# EAGLE design Moh2_RPi_HAT (EAGLE 9.5.0)
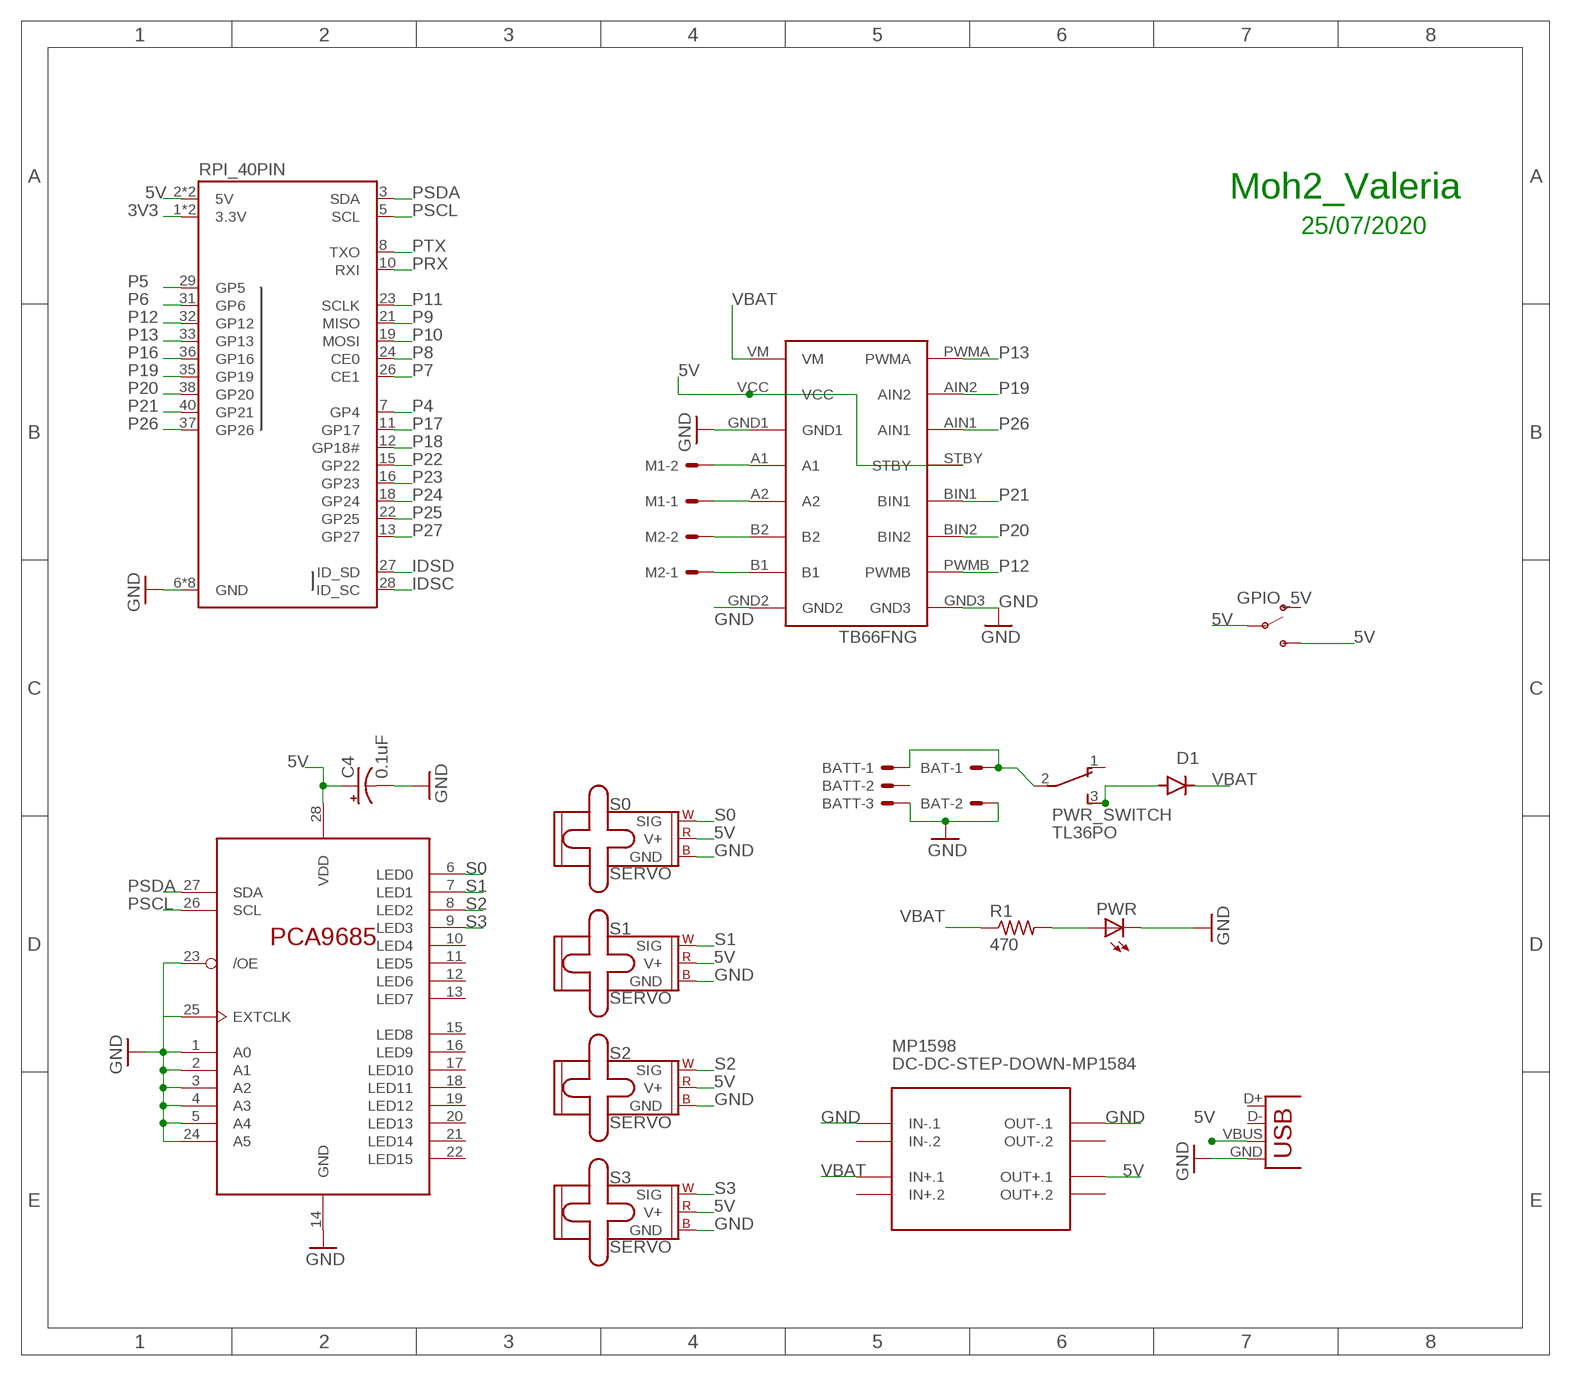
[diagram p0: schematic, sheet 1]

## Parts
BAT  22-05-7028-02  [7395-02]
BATT  22-05-7038-03  [7395-03]
C4  0.1uF  CPOL-USE1.8-4  [E1,8-4]
D1  1N5400  [DO201-15]
GPIO_5V  SWITCH-SPDT-PTH-11.6X4.0MM  [SWITCH_SPDT_PTH_11.6X4.0MM]
M1  22-05-7028-02  [7395-02]
M2  22-05-7028-02  [7395-02]
MP1598  DC-DC-STEP-DOWN-MP1584  [DC-DC-STEP-DOWN-MP1584]
PCA96  PCA9685PW  [TSSOP28]
PWR  LED5MM  [LED5MM]
PWR_SWITCH  TL36PO  [TL3XPO]
R1  470  R-US_0204/7  [0204/7]
RPI_40PIN  RASPBERRYPI-40-PIN-GPIO_PTH_NO_SHROUD  [2X20]
RPI_PWR  USB-A-H  [USB-A-H]
S0  SERVO  [1X03]
S1  SERVO  [1X03]
S2  SERVO  [1X03]
S3  SERVO  [1X03]
TB66FNG  TB6612FNG  [TB6612FNG]

## Nets
3V3: RPI_40PIN.1(3.3V) RPI_40PIN.17(3.3V)
5V: C4.+ GPIO_5V.2(P) GPIO_5V.3(S) MP1598.OUT+.1 PCA96.28(VDD) RPI_40PIN.2(5V) RPI_40PIN.4(5V) RPI_PWR.VBUS S0.2(V+) S1.2(V+) S2.2(V+) S3.2(V+) TB66FNG.STBY TB66FNG.VCC
11.1V+: BAT.1 BATT.1 PWR_SWITCH.2(P)
GND: BAT.2 BATT.3 C4.- MP1598.IN-.1 MP1598.OUT-.1 PCA96.1(A0) PCA96.2(A1) PCA96.3(A2) PCA96.4(A3) PCA96.5(A4) PCA96.14(GND) PCA96.23(/OE) PCA96.24(A5) PCA96.25(EXTCLK) PWR.K(C) RPI_40PIN.6(GND) RPI_40PIN.9(GND) RPI_40PIN.14(GND) RPI_40PIN.20(GND) RPI_40PIN.25(GND) RPI_40PIN.30(GND) RPI_40PIN.34(GND) RPI_40PIN.39(GND) RPI_PWR.GND S0.3(GND) S1.3(GND) S2.3(GND) S3.3(GND) TB66FNG.GND1 TB66FNG.GND2 TB66FNG.GND3
IDSC: RPI_40PIN.28(ID_SC)
IDSD: RPI_40PIN.27(ID_SD)
N$2: M2.2 TB66FNG.B2
N$3: D1.A PWR_SWITCH.3(S)
N$4: M1.2 TB66FNG.A1
N$5: M1.1 TB66FNG.A2
N$6: M2.1 TB66FNG.B1
N$10: PWR.A R1.2
P4: RPI_40PIN.7(GP4)
P5: RPI_40PIN.29(GP5)
P6: RPI_40PIN.31(GP6)
P7: RPI_40PIN.26(CE1)
P8: RPI_40PIN.24(CE0)
P9: RPI_40PIN.21(MISO)
P10: RPI_40PIN.19(MOSI)
P11: RPI_40PIN.23(SCLK)
P12: RPI_40PIN.32(GP12) TB66FNG.PWMB
P13: RPI_40PIN.33(GP13) TB66FNG.PWMA
P16: RPI_40PIN.36(GP16)
P17: RPI_40PIN.11(GP17)
P18: RPI_40PIN.12(GP18#)
P19: RPI_40PIN.35(GP19) TB66FNG.AIN2
P20: RPI_40PIN.38(GP20) TB66FNG.BIN2
P21: RPI_40PIN.40(GP21) TB66FNG.BIN1
P22: RPI_40PIN.15(GP22)
P23: RPI_40PIN.16(GP23)
P24: RPI_40PIN.18(GP24)
P25: RPI_40PIN.22(GP25)
P26: RPI_40PIN.37(GP26) TB66FNG.AIN1
P27: RPI_40PIN.13(GP27)
PRX: RPI_40PIN.10(RXI)
PSCL: PCA96.26(SCL) RPI_40PIN.5(SCL)
PSDA: PCA96.27(SDA) RPI_40PIN.3(SDA)
PTX: RPI_40PIN.8(TXO)
S0: PCA96.6(LED0) S0.1(SIG)
S1: PCA96.7(LED1) S1.1(SIG)
S2: PCA96.8(LED2) S2.1(SIG)
S3: PCA96.9(LED3) S3.1(SIG)
VBAT: D1.C MP1598.IN+.1 R1.1 TB66FNG.VM
Unconnected: BATT.2 GPIO_5V.1(O) MP1598.IN+.2 MP1598.IN-.2 MP1598.OUT+.2 MP1598.OUT-.2 PCA96.10(LED4) PCA96.11(LED5) PCA96.12(LED6) PCA96.13(LED7) PCA96.15(LED8) PCA96.16(LED9) PCA96.17(LED10) PCA96.18(LED11) PCA96.19(LED12) PCA96.20(LED13) PCA96.21(LED14) PCA96.22(LED15) PWR_SWITCH.1(O) RPI_PWR.D+ RPI_PWR.D-

## Notes on the sheet
- Moh2_Valeria
- 25/07/2020

## Library data of the parts
BAT M1 M2 = con-molex:22-?-02: CONNECTOR wire to board 2.54 mm (.1 inch) pitch header; MF: MOLEX; OC_FARNELL: 9731601; OC_NEWARK: unknown
BATT = con-molex:22-?-03: CONNECTOR wire to board 2.54 mm (.1 inch) pitch header; MF: MOLEX; OC_FARNELL: unknown; OC_NEWARK: unknown
C4 = rcl:CPOL-US: POLARIZED CAPACITOR, American symbol; SPICEPREFIX: C
D1 = diode:1N5400: DIODE standard rectifier, 3 A, 50 V (Motorola)
GPIO_5V = SparkFun-Switches:SWITCH-SPDT: Single Pole, Double Throw (SPDT) Switch Single-pole, double-throw (SPDT) switch. Variant Overview SMD-AYZ0202 Surface Mount DPDT Switch <https://www.sparkfun.com/products/597> (COM-00597) Used on e.g. LilyPad Arduino USB - ATmega32U4 Board <https://www.sparkfun.com/products/12049> PTH-11.6X4.0MM SPDT Mini Power Switch <https://www.sparkfun.com/products/102> (COM-00102) Used on e.g. SparkFun Simon Says - Through-Hole Soldering Kit <https://www.sparkfun.com/products/10547> (KIT-10547) PTH-11.6X4.0MM-KIT KIT version of SPDT Mini Power Switch - Simplifies soldering by removing tStop of switch pins - only one side can be soldered. PTH-11.6X4.0MM-LOCK LOCK version of SPDT Mini Power Switch - Offset pins hold switch in place for easier soldering. SMD-RIGHT-ANGLE Surface Mount Right Angle Switch <https://www.sparkfun.com/products/10860> (COM-10860) Used on e.g. SparkFun ESP8266 Thing <https://www.sparkfun.com/products/13231>; PROD_ID: SWCH-08261; SF_SKU: COM-00102
MP1598 = diy-modules:DC-DC-STEP-DOWN-MP1584: DC/DC Step-Down Regulator based on MP1584 chip MP1584 datasheet available here: http://www.haoyuelectronics.com/Attachment/MP1584/MP1584.pdf Click here to find device on ebay.com <http://www.ebay.com/sch/mp1584+module>
PCA96 = PCA9685pw:PCA9685
PWR = led:LED: LED OSRAM: - CHIPLED LG R971, LG N971, LY N971, LG Q971, LY Q971, LO R971, LY R971 LH N974, LH R974 LS Q976, LO Q976, LY Q976 LO Q996 - Hyper CHIPLED LW Q18S LB Q993, LB Q99A, LB R99A - SideLED LS A670, LO A670, LY A670, LG A670, LP A670 LB A673, LV A673, LT A673, LW A673 LH A674 LY A675 LS A676, LA A676, LO A676, LY A676, LW A676 LS A679, LY A679, LG A679 - Hyper Micro SIDELED® LS Y876, LA Y876, LO Y876, LY Y876 LT Y87S - SmartLED LW L88C, LW L88S LB L89C, LB L89S, LG L890 LS L89K, LO L89K, LY L89K LS L896, LA L896, LO L896, LY L896 - TOPLED LS T670, LO T670, LY T670, LG T670, LP T670 LSG T670, LSP T670, LSY T670, LOP T670, LYG T670 LG T671, LOG T671, LSG T671 LB T673, LV T673, LT T673, LW T673 LH T674 LS T676, LA T676, LO T676, LY T676, LB T676, LH T676, LSB T676, LW T676 LB T67C, LV T67C, LT T67C, LS T67K, LO T67K, LY T67K, LW E67C LS E67B, LA E67B, LO E67B, LY E67B, LB E67C, LV E67C, LT E67C LW T67C LS T679, LY T679, LG T679 LS T770, LO T770, LY T770, LG T770, LP T770 LB T773, LV T773, LT T773, LW T773 LH T774 LS E675, LA E675, LY E675, LS T675 LS T776, LA T776, LO T776, LY T776, LB T776 LHGB T686 LT T68C, LB T68C - Hyper Mini TOPLED® LB M676 - Mini TOPLED Santana® LG M470 LS M47K, LO M47K, LY M47K Source: http://www.osram.convergy.de LUXEON: - LUMILED® LXK2-PW12-R00, LXK2-PW12-S00, LXK2-PW14-U00, LXK2-PW14-V00 LXK2-PM12-R00, LXK2-PM12-S00, LXK2-PM14-U00 LXK2-PE12-Q00, LXK2-PE12-R00, LXK2-PE12-S00, LXK2-PE14-T00, LXK2-PE14-U00 LXK2-PB12-K00, LXK2-PB12-L00, LXK2-PB12-M00, LXK2-PB14-N00, LXK2-PB14-P00, LXK2-PB14-Q00 LXK2-PR12-L00, LXK2-PR12-M00, LXK2-PR14-Q00, LXK2-PR14-R00 LXK2-PD12-Q00, LXK2-PD12-R00, LXK2-PD12-S00 LXK2-PH12-R00, LXK2-PH12-S00 LXK2-PL12-P00, LXK2-PL12-Q00, LXK2-PL12-R00 Source: www.luxeon.com KINGBRIGHT: KA-3528ASYC Source: www.kingbright.com
PWR_SWITCH = switch:TL36PO: TINY SWITCH ON - ON Source: http://www2.produktinfo.conrad.com/datenblaetter/700000-724999/705152-da-01-de-Subminiaturschalter_TL_36YO.pdf
R1 = rcl:R-US_: RESISTOR, American symbol; SPICEPREFIX: R
RPI_40PIN = SparkFun-Connectors:RASPBERRYPI-40-PIN-GPIO: Raspberry Pi GPIO Header 2x20 pin connector, as found on B, B+, A+ models. Both shrouded PTH and SMT versions available. SparkFun Products: GPIO Shrouded Header <https://www.sparkfun.com/products/13054>- PTH SparkFun Pi Wedge (Preassembled) <https://www.sparkfun.com/products/13717>
RPI_PWR = con-usb:USB: USB Connectors
S0 S1-S3 = SparkFun-Electromechanical:SERVO: Servo Motor 3-pin connector for a standard servo motor (voltage supply, ground, and control signal.) SparkFun Products Servo - Generic (Sub-Micro Size) <https://www.sparkfun.com/products/9065> (ROB-09065) Servo - Generic High Torque Continuous Rotation (Standard Size) <https://www.sparkfun.com/products/9347> (ROB-09347) Servo - Generic High Torque (Standard Size) <https://www.sparkfun.com/products/11965> (ROB-11965)
TB66FNG = TB6612FNG:TB6612FNG

## Board
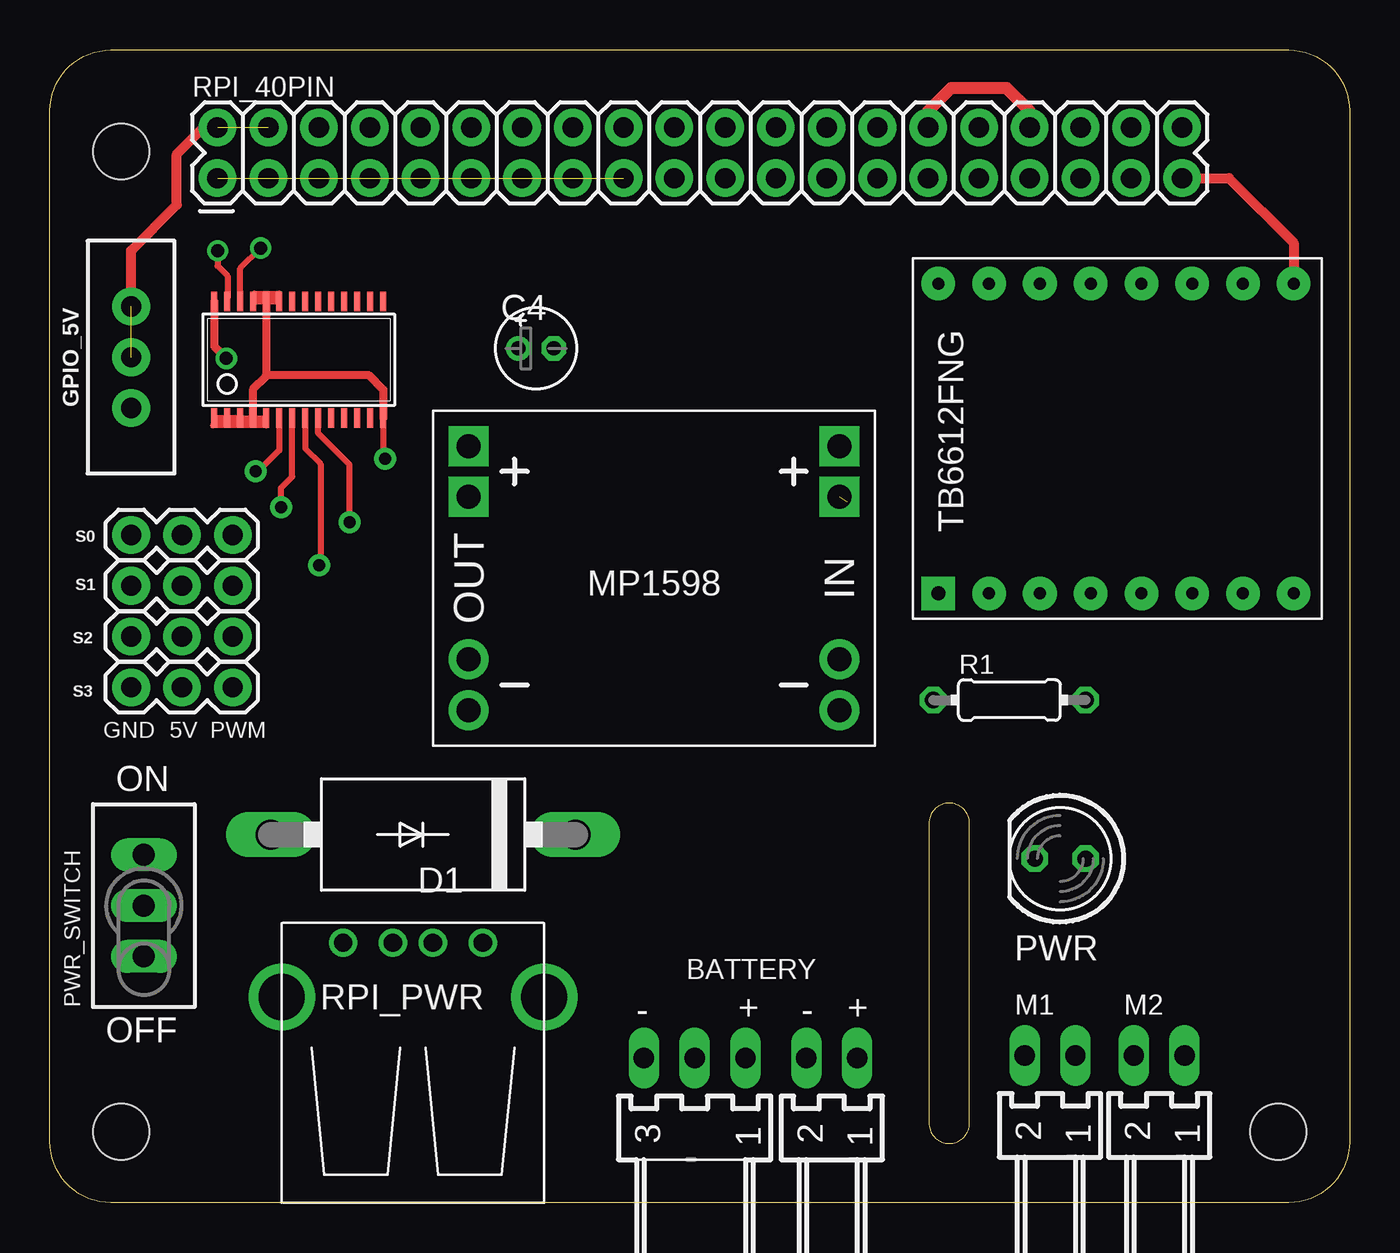
[diagram p1: board, top side]
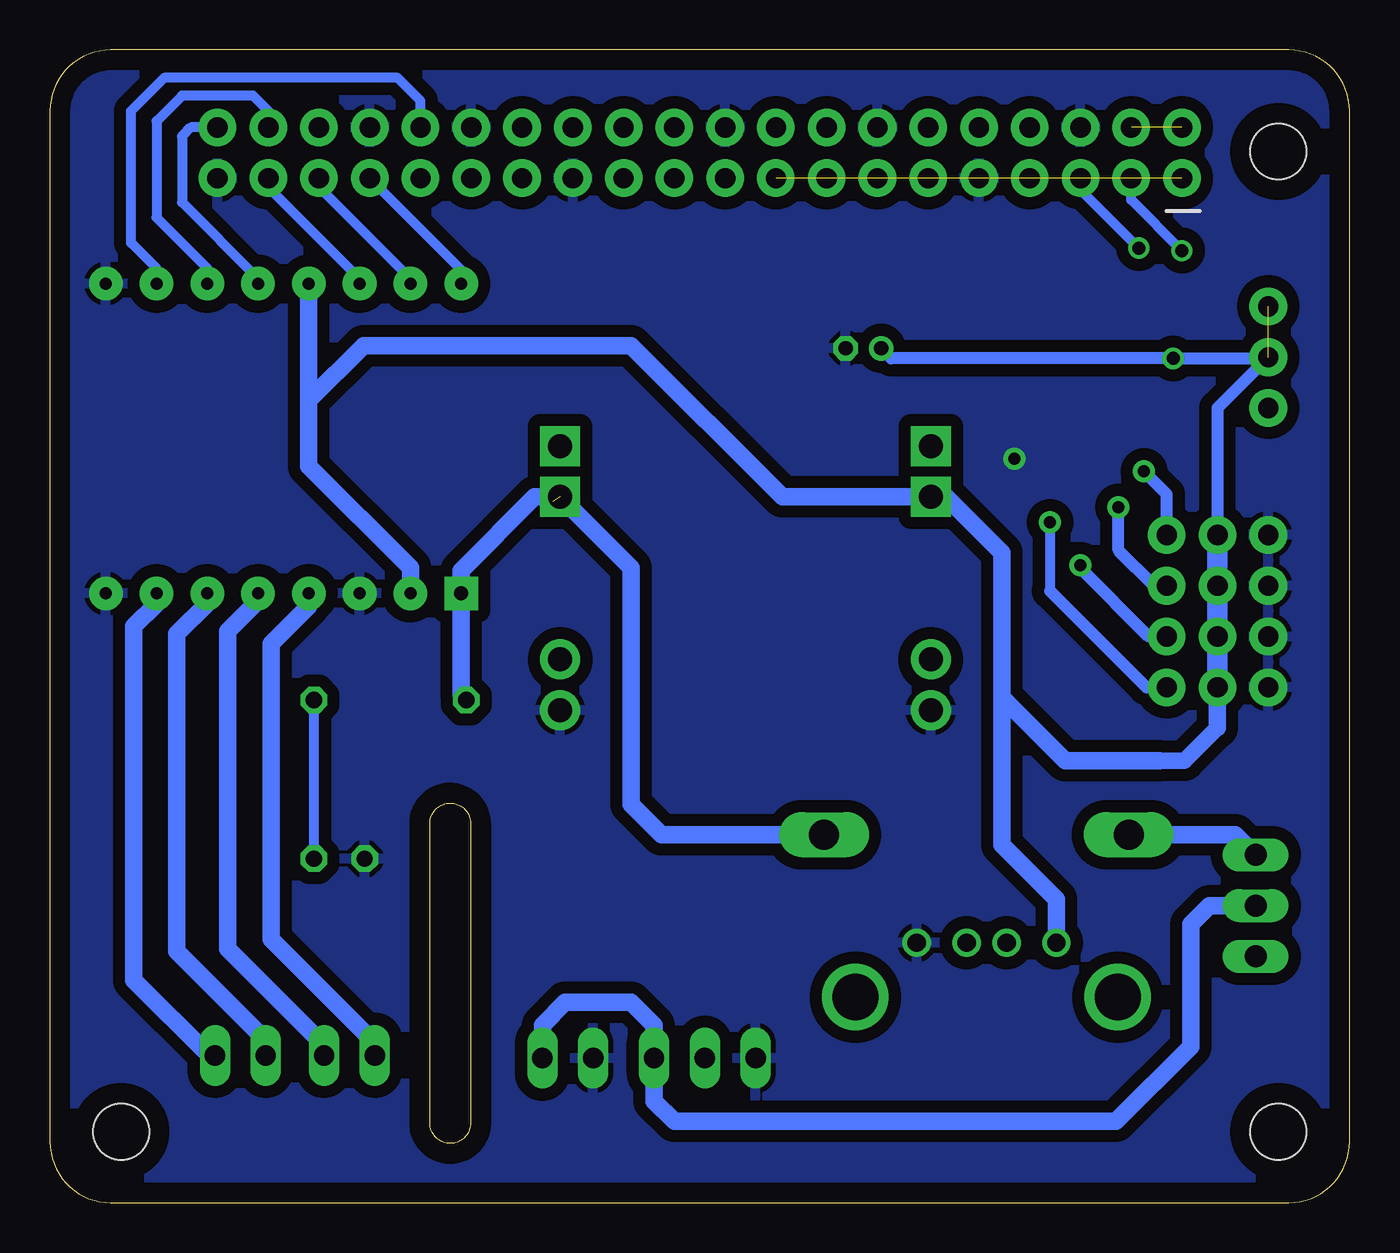
[diagram p2: board, bottom side, seen from below]

Size 65.02 x 57.66 mm. Coordinates in mm from the lower left corner, seen from the top.
Outline: 43.98,18.97 43.98,3.98 arc90 45,2.97 arc90 46.02,3.98 46.02,18.97 arc90 45,19.99 arc90 43.98,18.97
Outline: 3.05,0 arc-90 0,3.05 0,54.61 arc-90 3.05,57.66 61.98,57.66 arc-90 65.02,54.61 65.02,3.05 arc-90 61.98,0 3.05,0
Copper layers (1*16): Top 0.035mm / dielectric 1.5mm / Bottom 0.035mm
Design rules "default": minimum track width 6mil, minimum drill 0.35mm, track to track 6mil, track to pad 6mil, pad to pad 6mil, via to via 6mil, smd to smd 6mil, copper to edge 40mil, drill to drill 6mil, minimum pad ring 10mil, minimum via ring 8mil, stop-mask expansion 4mil, vias tented up to drill 0mil, thermal gap 10mil
Holes 2.79 mm at 3.56,3.56 61.47,3.56 3.56,52.58

### Footprints (pad centres in the part's own frame; a part is rotated, then mirrored left to right if it is on the bottom)
7395-02 = drill 1.016 long: 1 1.27,0; 2 -1.27,0
7395-03 = drill 1.016 long: 1 2.54,0; 2 0,0; 3 -2.54,0
E1,8-4 = drill 0.711 pad 1.168: + -0.889,0 | drill 0.711 pad 1.168 octagon: - 0.889,0
DO201-15 = drill 1.499 long: A 7.62,0; C -7.62,0
SWITCH_SPDT_PTH_11.6X4.0MM = drill 1.016 pad 1.88: 1 0,2.54; 2 0,0; 3 0,-2.54
DC-DC-STEP-DOWN-MP1584 = drill 1.2 pad 2 square: IN+.1 -9.271,-4.064; IN+.2 -9.271,-6.604; OUT+.1 9.271,-4.064; OUT+.2 9.271,-6.604 | drill 1.2 pad 2: IN-.1 -9.271,6.604; IN-.2 -9.271,4.064; OUT-.1 9.271,6.604; OUT-.2 9.271,4.064
TSSOP28 = smd 0.305 x 0.991: 1 -4.225,-2.918; 2 -3.575,-2.918; 3 -2.925,-2.918; 4 -2.275,-2.918; 5 -1.625,-2.918; 6 -0.975,-2.918; 7 -0.325,-2.918; 8 0.325,-2.918; 9 0.975,-2.918; 10 1.625,-2.918; 11 2.275,-2.918; 12 2.925,-2.918; 13 3.575,-2.918; 14 4.225,-2.918; 15 4.225,2.918; 16 3.575,2.918; 17 2.925,2.918; 18 2.275,2.918; 19 1.625,2.918; 20 0.975,2.918; 21 0.325,2.918; 22 -0.325,2.918; 23 -0.975,2.918; 24 -1.625,2.918; 25 -2.275,2.918; 26 -2.925,2.918; 27 -3.575,2.918; 28 -4.225,2.918
LED5MM = drill 0.813 octagon: A -1.27,0; K 1.27,0
TL3XPO = drill 1.1 pad 1.422 long: 1 -2.54,0; 2 0,0; 3 2.54,0
0204/7 = drill 0.813 octagon: 1 -3.81,0; 2 3.81,0
2X20 = drill 1.016 pad 1.88: 1 0,0; 2 0,2.54; 3 2.54,0; 4 2.54,2.54; 5 5.08,0; 6 5.08,2.54; 7 7.62,0; 8 7.62,2.54; 9 10.16,0; 10 10.16,2.54; 11 12.7,0; 12 12.7,2.54; 13 15.24,0; 14 15.24,2.54; 15 17.78,0; 16 17.78,2.54; 17 20.32,0; 18 20.32,2.54; 19 22.86,0; 20 22.86,2.54; 21 25.4,0; 22 25.4,2.54; 23 27.94,0; 24 27.94,2.54; 25 30.48,0; 26 30.48,2.54; 27 33.02,0; 28 33.02,2.54; 29 35.56,0; 30 35.56,2.54; 31 38.1,0; 32 38.1,2.54; 33 40.64,0; 34 40.64,2.54; 35 43.18,0; 36 43.18,2.54; 37 45.72,0; 38 45.72,2.54; 39 48.26,0; 40 48.26,2.54
USB-A-H = drill 0.914: D+ 2.718,-1.003; D- 2.718,1.003; GND 2.718,-3.493; VBUS 2.718,3.493 | drill 2.311: P$5 0,-6.566; P$6 0,6.566
1X03 = drill 1.016 pad 1.88: 1 0,0; 2 2.54,0; 3 5.08,0
TB6612FNG = drill 0.6 pad 1.676: A1 -7.62,-1.27; A2 -7.62,-3.81; AIN1 7.874,1.27; AIN2 7.874,3.81; B1 -7.62,-8.89; B2 -7.62,-6.35; BIN1 7.874,-3.81; BIN2 7.874,-6.35; GND1 -7.62,1.27; GND2 -7.62,-11.43; GND3 7.874,-11.43; PWMA 7.874,6.35; PWMB 7.874,-8.89; STBY 7.874,-1.27; VCC -7.62,3.81 | drill 0.7 pad 1.676 square: VM -7.62,6.35

### Placement (x,y rotation side)
BAT  39.12,7.24 0 top
BATT  32.26,7.24 0 top
C4  24.32,42.74 0 top
D1  18.67,18.41 180 top
GPIO_5V  4.06,42.29 180 top
M1  50.04,7.37 0 top
M2  55.5,7.37 0 top
MP1598  30.23,31.24 180 top
PCA96  12.45,42.16 0 top
PWR  50.55,17.21 180 top
PWR_SWITCH  4.7,14.86 90 top
R1  48.01,25.15 0 top
RPI_40PIN  8.38,51.24 0 top
RPI_PWR  18.16,10.29 90 top
S0  9.14,33.4 180 top
S1  9.14,30.86 180 top
S2  9.14,28.32 180 top
S3  9.14,25.78 180 top
TB66FNG  50.8,38.1 90 top

### Tracks (layer width: path | path; a pad name or v marks a point on that pad's centre or on a via)
3V3  (1 unrouted)
5V  (via drill 0.65)  (2 unrouted)
  Top 0.406: PCA96.28 8.22,42.83 v8.83,42.23
  Top 0.508: RPI_40PIN.2 7.68,53.78 6.35,52.45 6.35,49.91 4.06,47.62 GPIO_5V.3
  Bottom 0.508: 52.07,40.13 52.07,40.64 | TB66FNG.STBY 52.07,45.72 | MP1598.OUT+.1 20.45,35.31 | S3.2 6.73,25.65 | 23.37,42.67 C4.+
  Bottom 0.61: C4.+ 22.92,42.23 v8.83,42.23 4.13,42.23 GPIO_5V.2 6.6,39.75 S0.2
  Bottom 0.813: 6.6,31.24 S1.2 | S3.2 6.6,24.64 | 6.6,23.75 8.26,22.1 9.53,22.1
  Bottom 0.864: 6.6,25.91 6.6,24.64 6.6,23.75 | 9.53,22.1 14.22,22.1 17.4,25.27 | RPI_PWR.VBUS 14.67,15.18 17.4,17.91 17.4,25.27 | 17.4,25.27 17.4,32.51 20.19,35.31 MP1598.OUT+.1 28.38,35.31 35.94,42.86 49.34,42.86 52.07,40.13 | TB66FNG.STBY 52.07,40.64 52.07,36.83 46.99,31.75 TB66FNG.VCC
  Bottom 1.016: S0.2 6.6,31.24 | S1.2 S2.2 6.6,25.91
11.1V+
  Bottom 0.864: PWR_SWITCH.2 7.01,14.86 7.94,13.93 7.94,7.81 11.68,4.06 33.78,4.06 34.8,5.08 BATT.1 34.8,8.89 35.94,10.03 39.24,10.03 40.39,8.89 BAT.1
GND  (via drill 0.6 pad 1.1)
  Top 0.305: PCA96.14 16.67,37.3 v16.76,37.21 | PCA96.5 PCA96.4 PCA96.3 PCA96.2 PCA96.1 8.47,38.99 10.57,38.99 PCA96.5 | PCA96.5 10.82,38.89 8.15,38.89 | PCA96.25 PCA96.23 | 10.23,45.47 11.47,45.47 11.47,45.28 10.37,45.28 PCA96.25 | PCA96.24 PCA96.25
  Top 0.406: PCA96.14 16.67,40.67 15.94,41.4 10.81,41.4 | PCA96.4 10.17,40.72 10.81,41.35 10.81,41.4 | PCA96.24 10.82,41.42 10.81,41.4
  Top 0.508: RPI_40PIN.39 58.99,51.24 62.23,48.01 TB66FNG.GND3
  Top 0.61: RPI_40PIN.30 43.94,54.61 45.09,55.75 47.88,55.75 49.02,54.61 RPI_40PIN.34
  pour Bottom (isolate 0.61): 0,54.61 0,3.05 arc90 3.05,0 61.98,0 arc90 65.02,3.05 65.02,54.61 arc90 61.98,57.66 3.05,57.66 arc90
N$2
  Bottom 0.864: M2.2 54.23,8.13 58.67,12.57 58.67,28.45 57.15,29.97 TB66FNG.B2
N$3
  Bottom 0.864: PWR_SWITCH.3 5.71,18.41 D1.A
N$4
  Bottom 0.864: M1.2 48.77,8 53.95,13.18 53.95,27.96 52.07,29.84 TB66FNG.A1
N$5
  Bottom 0.864: M1.1 51.31,7.87 56.13,12.7 56.13,28.57 54.61,30.1 TB66FNG.A2
N$6
  Bottom 0.864: M2.1 57.06,7.37 60.83,11.14 60.83,28.83 59.69,29.97 TB66FNG.B1
N$10
  Bottom 0.508: PWR.A 51.82,24.38 51.82,24.64 R1.2
P12
  Bottom 0.508: RPI_40PIN.32 46.48,55.12 47.62,56.26 59.31,56.26 60.96,54.61 60.96,48.01 59.69,46.74 TB66FNG.PWMB
P13
  Bottom 0.508: 44.64,46.16 43.94,46.16 RPI_40PIN.33 | TB66FNG.PWMA 44.64,46.16 | 44.96,46.16 44.64,46.16
P19
  Bottom 0.508: RPI_40PIN.35 51.56,50.8 46.99,46.23 TB66FNG.AIN2
P20
  Bottom 0.508: RPI_40PIN.38 54.1,54.61 54.86,55.37 58.42,55.37 59.69,54.1 59.69,49.28 57.15,46.74 TB66FNG.BIN2
P21
  Bottom 0.508: RPI_40PIN.40 57.98,53.78 58.42,53.34 58.42,50.04 54.61,46.23 TB66FNG.BIN1
P26
  Bottom 0.508: TB66FNG.AIN1 49.53,46.23 54.1,50.8 RPI_40PIN.37
PSCL  (via drill 0.65)
  Top 0.305: 9.52,45.59 PCA96.26 9.52,46.73 v10.54,47.75
  Bottom 0.508: v10.54,47.75 13.46,50.67 RPI_40PIN.5
PSDA  (via drill 0.65)
  Top 0.152: 8.87,45.21 PCA96.27
  Top 0.305: 8.87,45.21 8.89,45.23 8.89,46.35 8.38,46.86 v8.38,47.62
  Bottom 0.508: v8.38,47.62 10.92,50.16 RPI_40PIN.3
S0  (via drill 0.6 pad 1.1)
  Top 0.152: 11.43,39.2 PCA96.6
  Top 0.305: PCA96.6 11.47,37.63 10.41,36.58 v10.29,36.58
  Bottom 0.508: S0.1 9.14,34.04
  Bottom 0.61: S0.1 9.14,35.43 v10.29,36.58
S1  (via drill 0.6 pad 1.1)
  Top 0.305: PCA96.7 12.12,36.32 11.56,35.76 v11.56,34.8
  Bottom 0.61: S1.1 9.78,30.86 11.56,32.64 v11.56,34.8
S2  (via drill 0.6 pad 1.1)
  Top 0.305: PCA96.8 12.77,37.72 13.53,36.96 13.53,31.95
  Top 0.356: 13.53,31.95 v13.46,31.88
  Bottom 0.61: S2.1 10.03,28.32 13.46,31.75 v13.46,31.88
S3  (via drill 0.6 pad 1.1)
  Top 0.152: PCA96.9 13.46,39.2
  Top 0.305: PCA96.9 13.42,38.48 14.99,36.92 v14.99,34.04
  Bottom 0.508: v14.99,34.04 14.99,30.61
  Bottom 0.61: S3.1 10.16,25.78 14.99,30.61
VBAT  (1 unrouted)
  Bottom 0.508: 44.45,29.97 TB66FNG.VM 44.32,30.48 | 39.88,35.05 40.13,35.05 | 39.31,35.12 MP1598.IN+.1 | 44.45,25.4 R1.1
  Bottom 0.864: 44.45,25.4 TB66FNG.VM 44.45,31.62 40.77,35.31 MP1598.IN+.1 35.94,31.75 35.94,19.94 34.42,18.41 D1.C

### Text on the board
tPlace: GND | 5V | PWM | ON | - | + | - | + | OFF
tNames: BATTERY